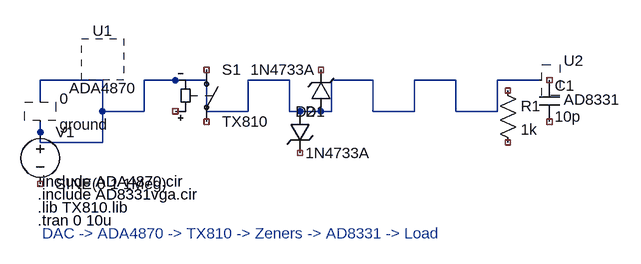
[diagram p0: schematic ultrasound_system_cleaned.asc]
ultrasound_system_cleaned.asc, the LTspice schematic file:
Version 4
SHEET 1 880 680
WIRE 64 96 64 64
WIRE 64 64 160 64
WIRE 160 64 160 112
WIRE 160 112 224 112
WIRE 224 112 224 64
WIRE 224 64 320 64
WIRE 320 64 320 112
WIRE 320 112 384 112
WIRE 384 112 384 64
WIRE 384 64 448 64
WIRE 448 64 448 112
WIRE 448 112 512 112
WIRE 512 112 512 64
WIRE 512 64 576 64
WIRE 576 64 576 112
WIRE 576 112 640 112
WIRE 640 112 640 64
WIRE 640 64 704 64
WIRE 704 64 704 112
WIRE 704 112 768 112
WIRE 768 112 768 64
WIRE 768 64 832 64
WIRE 64 128 64 160
WIRE 64 160 160 160
WIRE 160 160 160 112

SYMBOL voltage 64 128 R0
SYMATTR InstName V1
SYMATTR Value SINE(0 1 1Meg)

SYMBOL opamp2 160 32 R0
SYMATTR InstName U1
SYMATTR Value ADA4870

SYMBOL sw 320 32 R0
SYMATTR InstName S1
SYMATTR Value TX810

SYMBOL zener 448 112 R0
SYMATTR InstName D1
SYMATTR Value 1N4733A

SYMBOL zener 512 112 R180
SYMATTR InstName D2
SYMATTR Value 1N4733A

SYMBOL opamp2 576 32 R0
SYMATTR InstName U2
SYMATTR Value AD8331

SYMBOL res 768 64 R0
SYMATTR InstName R1
SYMATTR Value 1k

SYMBOL cap 832 64 R0
SYMATTR InstName C1
SYMATTR Value 10p

SYMBOL ground 64 160 R0
SYMATTR InstName 0

TEXT 60 220 Left 2 !.include ADA4870.cir
TEXT 60 240 Left 2 !.include AD8331vga.cir
TEXT 60 260 Left 2 !.lib TX810.lib
TEXT 60 280 Left 2 !.tran 0 10u
TEXT 60 300 Left 2 ; DAC -> ADA4870 -> TX810 -> Zeners -> AD8331 -> Load

The netlist it stands for:
* ultrasound_system_cleaned.asc
V1 N001 NC_01 SINE(0 1 1Meg)
* U1: ADA4870 (symbol opamp2 not available, pin order unknown); nets seen at it: 
S1 NC_02 NC_03 NC_04 N001 TX810
D1 N001 NC_05 1N4733A
D2 N001 NC_06 1N4733A
* U2: AD8331 (symbol opamp2 not available, pin order unknown); nets seen at it: N001
R1 NC_07 NC_08 1k
C1 NC_09 NC_10 10p
* 0: ground (symbol ground not available, pin order unknown); nets seen at it: N001
.model D D
.lib standard.dio
.include ADA4870.cir
.include AD8331vga.cir
.lib TX810.lib
.tran 0 10u
*  DAC -> ADA4870 -> TX810 -> Zeners -> AD8331 -> Load
.backanno
.end